# Altium project H4_6-port_EtherCAT_Junction_Module.PrjPcb (part 6 of 7)

## Sheet LAN9254_A_P1.SchDoc
size 431 x 279 mm; DocumentNumber: 4; SheetNumber: 4; SheetTotal: 13
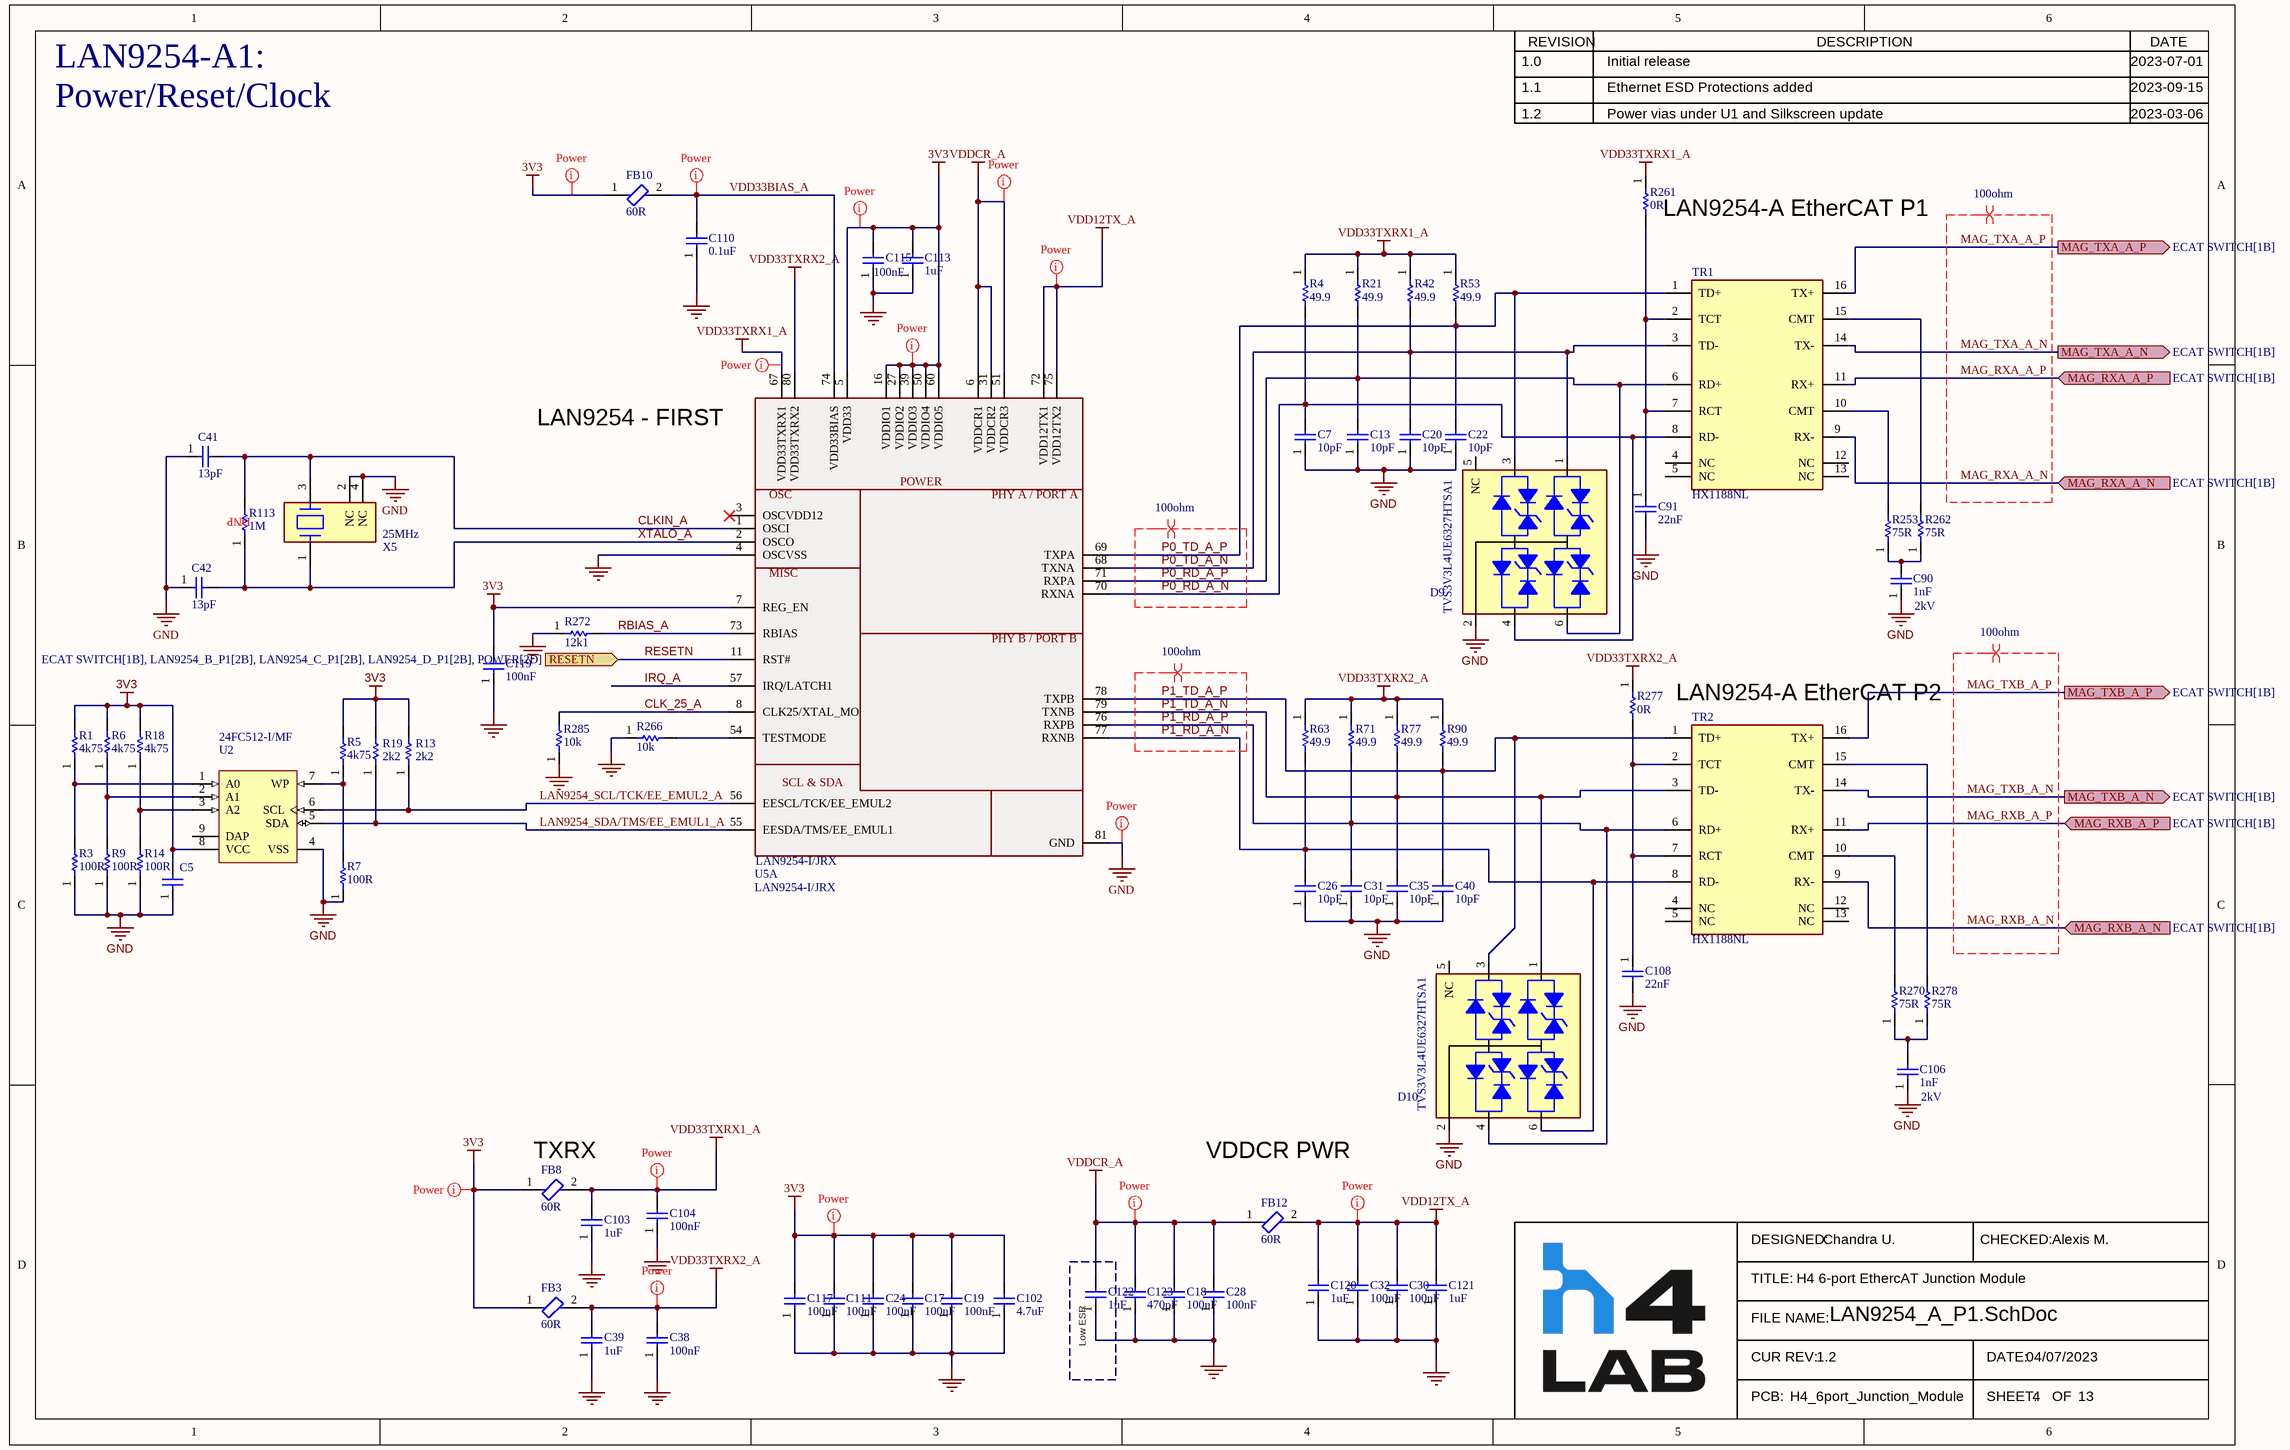
[diagram p9: LAN9254_A_P1.SchDoc]

### Parts
C5  GRM155R71C104JA88D  [CAPC1005X03N(0402)]  (value not drawn)
C7  value 10pF  [0402_C]  (hidden comment: C0402C100J5GAC7411)
C13  value 10pF  [0402_C]  (hidden comment: C0402C100J5GAC7411)
C17  value 100nF  [CAPC1005X03N(0402)]  (hidden comment: GRM155R71C104JA88D)
C18  value 100nF  [CAPC1005X03N(0402)]  (hidden comment: GRM155R71C104JA88D)
C19  value 100nF  [CAPC1005X03N(0402)]  (hidden comment: GRM155R71C104JA88D)
C20  value 10pF  [0402_C]  (hidden comment: C0402C100J5GAC7411)
C22  value 10pF  [0402_C]  (hidden comment: C0402C100J5GAC7411)
C24  value 100nF  [CAPC1005X03N(0402)]  (hidden comment: GRM155R71C104JA88D)
C26  value 10pF  [0402_C]  (hidden comment: C0402C100J5GAC7411)
C28  value 100nF  [CAPC1005X03N(0402)]  (hidden comment: GRM155R71C104JA88D)
C30  value 100nF  [CAPC1005X03N(0402)]  (hidden comment: GRM155R71C104JA88D)
C31  value 10pF  [0402_C]  (hidden comment: C0402C100J5GAC7411)
C32  value 100nF  [CAPC1005X03N(0402)]  (hidden comment: GRM155R71C104JA88D)
C35  value 10pF  [0402_C]  (hidden comment: C0402C100J5GAC7411)
C38  value 100nF  [CAPC1005X03N(0402)]  (hidden comment: GRM155R71C104JA88D)
C39  value 1uF  [CAPC1608X09N(0603)]  (hidden comment: C0603C105K3PACTU)
C40  value 10pF  [0402_C]  (hidden comment: C0402C100J5GAC7411)
C41  value 13pF  [0402_C]  (hidden comment: GRM0225C1H130GA03L)
C42  value 13pF  [0402_C]  (hidden comment: GRM0225C1H130GA03L)
C90  value 1nF  Voltage Rating: 2kV  [CAPC3216X16N(1206)]  (hidden comment: CC1206KKX7RDBB102)
C91  value 22nF  [CAPC1005X03N(0402)]  (hidden comment: GCM155R71H223KA55D)
C102  value 4.7uF  [CAPC3216X16N(1206)]  (hidden comment: CL31B475KBHNNNE)
C103  value 1uF  [CAPC1608X09N(0603)]  (hidden comment: C0603C105K3PACTU)
C104  value 100nF  [CAPC1005X03N(0402)]  (hidden comment: GRM155R71C104JA88D)
C106  value 1nF  Voltage Rating: 2kV  [CAPC3216X16N(1206)]  (hidden comment: CC1206KKX7RDBB102)
C108  value 22nF  [CAPC1005X03N(0402)]  (hidden comment: GCM155R71H223KA55D)
C110  value 0.1uF  [CAPC1608X09N(0603)]  (hidden comment: CL10B104KC8NNNC)
C111  value 100nF  [CAPC1005X03N(0402)]  (hidden comment: GRM155R71C104JA88D)
C113  value 1uF  [0603_C]  (hidden comment: LMK107BJ105KA-T)
C115  value 100nF  [CAPC1005X03N(0402)]  (hidden comment: GRM155R71C104JA88D)
C117  value 100nF  [CAPC1005X03N(0402)]  (hidden comment: GRM155R71C104JA88D)
C119  value 100nF  [CAPC1005X03N(0402)]  (hidden comment: GRM155R71C104JA88D)
C120  value 1uF  [CAPC1608X09N(0603)]  (hidden comment: C0603C105K3PACTU)
C121  value 1uF  [CAPC1608X09N(0603)]  (hidden comment: C0603C105K3PACTU)
C122  value 1uF  [0603_C]  (hidden comment: LMK107BJ105KA-T)
C123  value 470pF  [CAPC1005X03N(0402)]  (hidden comment: GCM1555C1H471JA16D)
D9  TVS3V3L4UE6327HTSA1  [FP-SOT457-MFG]
D10  TVS3V3L4UE6327HTSA1  [FP-SOT457-MFG]
FB3  Impedance: 60R  [FP-BKP2125-IPC_C]  (hidden comment: BKP2125HS600-T)
FB8  Impedance: 60R  [FP-BKP2125-IPC_C]  (hidden comment: BKP2125HS600-T)
FB10  Impedance: 60R  [FP-BKP2125-IPC_C]  (hidden comment: BKP2125HS600-T)
FB12  Impedance: 60R  [FP-BKP2125-IPC_C]  (hidden comment: BKP2125HS600-T)
R1  value 4k75  [RESC1005X06N(0402)]  (hidden comment: RC0402FR-074K75L)
R3  value 100R  [0402]  (hidden comment: CRGCQ0402F100R)
R4  value 49.9  [RESC1005X06N(0402)]  (hidden comment: CRCW040249R9FKED)
R5  value 4k75  [RESC1005X06N(0402)]  (hidden comment: RC0402FR-074K75L)
R6  value 4k75  [RESC1005X06N(0402)]  (hidden comment: RC0402FR-074K75L)
R7  value 100R  [0402]  (hidden comment: CRGCQ0402F100R)
R9  value 100R  [0402]  (hidden comment: CRGCQ0402F100R)
R13  value 2k2  [0402]  (hidden comment: CRCW04022K20JNED)
R14  value 100R  [0402]  (hidden comment: CRGCQ0402F100R)
R18  value 4k75  [RESC1005X06N(0402)]  (hidden comment: RC0402FR-074K75L)
R19  value 2k2  [0402]  (hidden comment: CRCW04022K20JNED)
R21  value 49.9  [RESC1005X06N(0402)]  (hidden comment: CRCW040249R9FKED)
R42  value 49.9  [RESC1005X06N(0402)]  (hidden comment: CRCW040249R9FKED)
R53  value 49.9  [RESC1005X06N(0402)]  (hidden comment: CRCW040249R9FKED)
R63  value 49.9  [RESC1005X06N(0402)]  (hidden comment: CRCW040249R9FKED)
R71  value 49.9  [RESC1005X06N(0402)]  (hidden comment: CRCW040249R9FKED)
R77  value 49.9  [RESC1005X06N(0402)]  (hidden comment: CRCW040249R9FKED)
R90  value 49.9  [RESC1005X06N(0402)]  (hidden comment: CRCW040249R9FKED)
R113  value 1M  [RESC1608X09N(0603)]  (hidden comment: RC0603FR-071ML)
R253  value 75R  [RESC1005X06N(0402)]  (hidden comment: CRCW040275R0FKEDC)
R261  value 0R  [0402]  (hidden comment: RCS04020000Z0ED)
R262  value 75R  [RESC1005X06N(0402)]  (hidden comment: CRCW040275R0FKEDC)
R266  value 10k  [RESC1005X06N(0402)]  (hidden comment: RC0402FR-0710KL)
R270  value 75R  [RESC1005X06N(0402)]  (hidden comment: CRCW040275R0FKEDC)
R272  value 12k1  [RESC1005X06N(0402)]  (hidden comment: RC0402FR-0712K1L)
R277  value 0R  [0402]  (hidden comment: RCS04020000Z0ED)
R278  value 75R  [RESC1005X06N(0402)]  (hidden comment: CRCW040275R0FKEDC)
R285  value 10k  [RESC1005X06N(0402)]  (hidden comment: RC0402FR-0710KL)
TR1  HX1188NL  [FP-HX1188NL-MFG]
TR2  HX1188NL  [FP-HX1188NL-MFG]
U2  24FC512-I/MF  [DFNS-MF8]
U5  LAN9254-I/JRX  [QFP50P1400X1400X120-81N]  (part A of 2)
X5  Frequency: 25MHz  [FP-XRCGB-MFG]  (hidden comment: XRCGB25M000F3A00R0)

### Blocks framed on the sheet
Low ESR: C122

### Ports
MAG_RXA_A_N (in, see ECAT SWITCH[1B]), MAG_RXA_A_P (in, see ECAT SWITCH[1B]), MAG_RXB_A_N (in, see ECAT SWITCH[1B]), MAG_RXB_A_P (in, see ECAT SWITCH[1B]), MAG_TXA_A_N (out, see ECAT SWITCH[1B]), MAG_TXA_A_P (out, see ECAT SWITCH[1B]), MAG_TXB_A_N (out, see ECAT SWITCH[1B]), MAG_TXB_A_P (out, see ECAT SWITCH[1B]), RESETN (in, see ECAT SWITCH[1B], LAN9254_B_P1[2B], LAN9254_C_P1[2B], LAN9254_D_P1[2B], POWER[2D])

### Nets
3V3: C5.2 C17.2 C19.2 C24.2 C102.2 C111.2 C113.2 C115.2 C117.2 C119.2 FB3.1 FB8.1 FB10.1 R1.2 R5.2 R6.2 R13.2 R18.2 R19.2 U2.8(VCC) U5.5(VDD33) U5.7(REG_EN) U5.16(VDDIO1) U5.27(VDDIO2) U5.39(VDDIO3) U5.50(VDDIO4) U5.60(VDDIO5)
GND: C5.1 C7.1 C13.1 C17.1 C18.1 C19.1 C20.1 C22.1 C24.1 C26.1 C28.1 C30.1 C31.1 C32.1 C35.1 C38.1 C39.1 C40.1 C41.1 C42.1 C90.1 C91.2 C102.1 C103.1 C104.1 C106.1 C108.2 C110.1 C111.1 C113.1 C115.1 C117.1 C119.1 C120.1 C121.1 C122.1 C123.1 D9.2(GND) D10.2(GND) R3.1 R7.1 R9.1 R14.1 R266.1 R272.1 R285.1 U2.4(VSS) U5.4(OSCVSS) U5.81(GND) X5.2(NC) X5.4(NC)
VDD12TX_A: C30.2 C32.2 C120.2 C121.2 FB12.2 U5.72(VDD12TX1) U5.75(VDD12TX2)
VDD33TXRX1_A: C103.2 C104.2 FB8.2 R4.1 R21.1 R42.1 R53.1 R261.1 U5.67(VDD33TXRX1)
VDD33TXRX2_A: C38.2 C39.2 FB3.2 R63.1 R71.1 R77.1 R90.1 R277.1 U5.80(VDD33TXRX2)
VDDCR_A: C18.2 C28.2 C122.2 C123.2 FB12.1 U5.6(VDDCR1) U5.31(VDDCR2) U5.51(VDDCR3)
CLK_25_A: R285.2 U5.8(CLK25/XTAL_MO)
CLKIN_A: C41.2 R113.2 U5.1(OSCI) X5.3
IRQ_A: U5.57(IRQ/LATCH1)
LAN9254_SCL/TCK/EE_EMUL2_A: R13.1 U2.6(SCL) U5.56(EESCL/TCK/EE_EMUL2)
LAN9254_SDA/TMS/EE_EMUL1_A: R19.1 U2.5(SDA) U5.55(EESDA/TMS/EE_EMUL1)
MAG_RXA_A_N: TR1.9(RX-) ; port MAG_RXA_A_N
MAG_RXA_A_P: TR1.11(RX+) ; port MAG_RXA_A_P
MAG_RXB_A_N: TR2.9(RX-) ; port MAG_RXB_A_N
MAG_RXB_A_P: TR2.11(RX+) ; port MAG_RXB_A_P
MAG_TXA_A_N: TR1.14(TX-) ; port MAG_TXA_A_N
MAG_TXA_A_P: TR1.16(TX+) ; port MAG_TXA_A_P
MAG_TXB_A_N: TR2.14(TX-) ; port MAG_TXB_A_N
MAG_TXB_A_P: TR2.16(TX+) ; port MAG_TXB_A_P
P0_RD_A_N: C7.2 D9.4 R4.2 TR1.8(RD-) U5.70(RXNA)
P0_RD_A_P: C13.2 D9.6 R21.2 TR1.6(RD+) U5.71(RXPA)
P0_TD_A_N: C20.2 D9.1 R42.2 TR1.3(TD-) U5.68(TXNA)
P0_TD_A_P: C22.2 D9.3 R53.2 TR1.1(TD+) U5.69(TXPA)
P1_RD_A_N: C26.2 D10.6 R63.2 TR2.8(RD-) U5.77(RXNB)
P1_RD_A_P: C31.2 D10.4 R71.2 TR2.6(RD+) U5.76(RXPB)
P1_TD_A_N: C35.2 D10.1 R77.2 TR2.3(TD-) U5.79(TXNB)
P1_TD_A_P: C40.2 D10.3 R90.2 TR2.1(TD+) U5.78(TXPB)
RBIAS_A: R272.2 U5.73(RBIAS)
RESETN: U5.11(RST#) ; port RESETN
VDD33BIAS_A: C110.2 FB10.2 U5.74(VDD33BIAS)
XTALO_A: C42.2 R113.1 U5.2(OSCO) X5.1
NetC90_2: C90.2 R253.1 R262.1
NetC91_1: C91.1 R261.2 TR1.2(TCT) TR1.7(RCT)
NetC106_2: C106.2 R270.1 R278.1
NetC108_1: C108.1 R277.2 TR2.2(TCT) TR2.7(RCT)
NetR1_1: R1.1 R3.2 U2.1(A0)
NetR5_1: R5.1 R7.2 U2.7(WP)
NetR6_1: R6.1 R9.2 U2.2(A1)
NetR14_2: R14.2 R18.1 U2.3(A2)
NetR253_2: R253.2 TR1.10(CMT)
NetR262_2: R262.2 TR1.15(CMT)
NetR266_2: R266.2 U5.54(TESTMODE)
NetR270_2: R270.2 TR2.10(CMT)
NetR278_2: R278.2 TR2.15(CMT)

Not connected (* = marked no-connect by the designer): D9 5(NC); D10 5(NC); TR1 4(NC) 5(NC) 12(NC) 13(NC); TR2 4(NC) 5(NC) 12(NC) 13(NC); U2 9(DAP); U5 3(OSCVDD12)*

### Layout directives
net class Power: 3V3, GND, VDD12TX_A, VDD33BIAS_A, VDD33TXRX1_A, VDD33TXRX2_A, VDDCR_A
differential pair; differential pair class 100ohm: MAG_RXA_A_N, MAG_RXA_A_P, MAG_RXB_A_N, MAG_RXB_A_P, MAG_TXA_A_N, MAG_TXA_A_P, MAG_TXB_A_N, MAG_TXB_A_P, P0_RD_A_N, P0_RD_A_P, P0_TD_A_N, P0_TD_A_P, P1_RD_A_N, P1_RD_A_P, P1_TD_A_N, P1_TD_A_P

### Notes on the sheet
- LAN9254-A1:
- Power/Reset/Clock
- (near R261) LAN9254-A EtherCAT P1
- (near U5) LAN9254 - FIRST
- (near R113) DNP
- LAN9254-A EtherCAT P2
- (near FB8) TXRX
- VDDCR PWR
- REVISION
- DESCRIPTION
- DATE
- DESIGNED:
- CHECKED:
- TITLE:
- FILE NAME:
- CUR REV:
- PCB:
- SHEET:
- DATE:
- OF
- (in symbol LAN9254-I/JRX, part A) POWER; OSC; PHY A / PORT A; MISC; PHY B / PORT B; SCL & SDA

### Library data of the parts
C5 = 100nF_16V_0402_CAP: CAP CER 0.1UF 16V X7R 0402; Value: 100nF; Tolerance: 5%; MPN: GRM155R71C104JA88D; Voltage Rating: 16V; Temp Coeff: X7R; Size/Package: 0402
C7 C13 C20 C22 C26 C31 C35 C40 = 10pF_50V_0402_C0402C100J5GAC7411: Cap Ceramic 10pF 50V C0G 5% SMD 0402 125°C Punched Paper T/R; Manufacturer: KEMET; Tolerance: 5%; Supplier 1: Digi-Key; Manufacturer Part Number: C0402C100J5GAC7411; RoHS: Yes; Category: Ceramic Capacitors; Stock 1: 39987; Pricing 1: 1=0.10000, 10=0.03500, 50=0.01940, 100=0.01580, 500=0.01128, 1000=0.00886, 2500=0.00805, 5000=0.00741 (USD); Case/Package: 0402; Dielectric Material: Ceramic; Min Operating Temperature: -55°C; Max Operating Temperature: 125°C; Packaging: Tape and Reel; Capacitance: 10pF; Dielectric: C0G; Voltage Rating (DC): 50V; Length: 1mm; Depth: 0.5mm; Lead Free: Lead Free; RoHS Compliant: Yes; ComponentLink1URL: http://components.arrow.com/part/dataview/0323_00309912?src-supplier=Arrow+Europe; ComponentLink1Description: http://components.arrow.com/part/dataview/0323_00309912?src-supplier=Arrow+Europe; Supplier Part Number 1: 399-C0402C100J5GAC7411CT-ND
C17-C19 C24 C28 C30 C32 C38 C104 C111 C115 C117 C119 = 100nF_16V_0402_CAP: CAP CER 0.1UF 16V X7R 0402; Tolerance: 5%; MPN: GRM155R71C104JA88D; Voltage Rating: 16V; Temp Coeff: X7R; Size/Package: 0402
C39 C103 C120 C121 = 1uF_25VDC_0603_Cap: MLCC - SMD/SMT 25volts 1uF X5R 10%; Voltage: 25VDC; Drawn By: TC; MPN: C0603C105K3PACTU; Tolerance: 10%; Supplier 1: Mouser; Supplier Part Number 1: 80-C0603C105K3PAC
C41 C42 = 13pF_50V_0402_CAP_GRM0225C1H130GA03L: Cap Ceramic Monolithic 13pF 50VDC 2% SMD Emboss T/R; Manufacturer: Murata; Supplier 1: Digi-Key; Manufacturer Part Number: GRM0225C1H130GA03L; RoHS: Yes; Category: Ceramic Capacitors; Pricing 1: 40000=0.01108 (USD); RoHS Compliant: Yes; Supplier Part Number 1: 490-GRM0225C1H130GA03LTR-ND
C90 C106 = 1nF_2kV_1206_CAP: CAP CER 1000PF 2KV X7R 1206; Tolerance: 10%; MPN: CC1206KKX7RDBB102; Temp Coeff: X7R; Size/Package: 1206
C91 C108 = 22nF_50V_0402_CAP: CAP CER 0.022UF 50V X7R 0402; Tolerance: 10%; MPN: GCM155R71H223KA55D; Voltage Rating: 50V; Temp Coeff: X7R; Size/Package: 0402; Mounting Type: Surface Mounting
C102 = 4.7uF_50V_1206_CAP: CAP CER 4.7UF 50V X7R 1206; Tolerance: 10%; MPN: CL31B475KBHNNNE; Voltage: 50V; Temp Coeff: X7R; Package/Case: 1206
C110 = 0.1uF_100V_0603_CAP: CAP CER 0.1UF 100V X7R 0603; Tolerance: 10%; MPN: CL10B104KC8NNNC; Supplier 1: Digi-Key; Supplier Part Number 1: 1276-6807-1-ND; Volage Rating: 100V; Temp Coefficent: X7R; Mounting Type: Surface Mount; Case/Package: 0603
C113 C122 = 1uF_10V_low_ESR_0603_LMK107BJ105KA-T: Multilayer Ceramic Capacitors (High dielectric type), 10V, 1 uF, ± 10 %, 0603, X5R, RoHS; Manufacturer: Taiyo Yuden; Tolerance: 10%; Supplier 1: Digi-Key; Supplier Part Number 1: 587-4281-1-ND; Manufacturer Part Number: LMK107BJ105KA-T; RoHS: Yes; Category: Ceramic Capacitors; Stock 1: 254397; Pricing 1: 1=0.10000, 10=0.05800, 50=0.03180, 100=0.02590, 500=0.01852, 1000=0.01455 (USD); Mount: Surface Mount; Case/Package: 0603; Case Code (Imperial): 0603; Case Code (Metric): 1608; Min Operating Temperature: -55°C; Max Operating Temperature: 85°C; Packaging: Tape and Reel; Capacitance: 1uF; Voltage Rating (DC): 10V; Dielectric: X5R; Package Quantity: 4000; Voltage Rating: 10V; Termination: SMD/SMT; Resistor Type: Ceramic; Series: M; Construction: Flat; Length: 1.6mm; Width: 0.8mm; Height: 0.8mm; Thickness: 0.035inch; Depth: 0.8mm; Radiation Hardening: No; Lead Free: Lead Free; Halogen Free: Halogen Free; RoHS Compliant: Yes; ComponentLink1URL: https://datasheet.ciiva.com/11596/lmk107bj105ka-t-ss-11596793.pdf?src-supplier=Avnet; ComponentLink1Description: https://datasheet.ciiva.com/11596/lmk107bj105ka-t-ss-11596793.pdf?src-supplier=Avnet; ComponentLink2URL: https://datasheet.ciiva.com/15921/1054lmk107bj105ka-t-15921296.pdf?src-supplier=Onlinecomponents.com; ComponentLink2Description: https://datasheet.ciiva.com/15921/1054lmk107bj105ka-t-15921296.pdf?src-supplier=Onlinecomponents.com; ComponentLink3URL: https://datasheet.ciiva.com/26872/getdatasheetpartid-637529-26872638.pdf?src-supplier=Verical; ComponentLink3Description: https://datasheet.ciiva.com/26872/getdatasheetpartid-637529-26872638.pdf?src-supplier=Verical; ComponentLink4URL: https://datasheet.ciiva.com/30232/584lmk107bj105ka-t-30232760.pdf?src-supplier=Onlinecomponents.com; ComponentLink4Description: https://datasheet.ciiva.com/30232/584lmk107bj105ka-t-30232760.pdf?src-supplier=Onlinecomponents.com
C123 = 470pF_50V_0402_CAP: CAP CER 470PF 50V C0G/NP0 0402; Tolerance: 5%; Temp Coeff: C0G, NP0; MPN: GCM1555C1H471JA16D; Voltage: 50V; Size: 0402
D9 D10 = TVS_DIODE_ETHERCAT_PHY_7.7V_20A_TVS3V3L4UE6327HTSA1: Trans Voltage Suppressor Diode, 3.3V V(RWM), Unidirectional, 4 Element, Silicon; Manufacturer: Infineon; Supplier: Digi-Key; Supplier Part Number: TVS3V3L4UE6327HTSA1CT-ND; Manufacturer Part Number: TVS3V3L4UE6327HTSA1; RoHS: Yes; Category: Diodes; Stock: 273244; Pricing: 1=0.54, 10=0.438, 100=0.2981, 500=0.22356, 1000=0.16767 (USD); Terminal Finish: Tin; Diode Type: TRANS VOLTAGE SUPPRESSOR; Moisture Sensitivity Level: 1; JESD-609 Code: e3; Reach SVHC Compliant: Yes; RoHS Compliant: Yes; ComponentLink1URL: https://datasheet.ciiva.com:443/pdfs/VipMasterIC/IC/INFN/INFNS19177/INFNS19177-1.pdf?src-supplier=IHS+Markit; ComponentLink1Description: https://datasheet.ciiva.com:443/pdfs/VipMasterIC/IC/INFN/INFNS19177/INFNS19177-1.pdf?src-supplier=IHS+Markit; ComponentLink2URL: http://www.farnell.com/datasheets/1945807.pdf?src-supplier=Farnell; ComponentLink2Description: http://www.farnell.com/datasheets/1945807.pdf?src-supplier=Farnell; ComponentLink3URL: http://www.mouser.com/ds/2/196/Infineon-TVS3V3L4U-DS-v02_04-en-469488.pdf?src-supplier=Mouser; ComponentLink3Description: http://www.mouser.com/ds/2/196/Infineon-TVS3V3L4U-DS-v02_04-en-469488.pdf?src-supplier=Mouser; ComponentLink4URL: http://www.farnell.com/datasheets/1945807.pdf?src-supplier=Element14; ComponentLink4Description: http://www.farnell.com/datasheets/1945807.pdf?src-supplier=Element14; ComponentLink5URL: http://www.farnell.com/datasheets/1945807.pdf?src-supplier=Newark; ComponentLink5Description: http://www.farnell.com/datasheets/1945807.pdf?src-supplier=Newark; ComponentLink6URL: http://www.infineon.com/dgdl/Infineon-TVS3V3L4U-DS-v02_04-en.pdf?fileId=db3a3043382e837301385be7912532ed&src-supplier=Avnet; ComponentLink6Description: http://www.infineon.com/dgdl/Infineon-TVS3V3L4U-DS-v02_04-en.pdf?fileId=db3a3043382e837301385be7912532ed&src-supplier=Avnet; ComponentLink7URL: https://www.infineon.com/dgdl/TVS3V3L4U_rev_2_2.pdf?folderId=db3a30431f848401011fcbf2ab4c04c4&fileId=db3a3043382e837301385be7912532ed&src-supplier=Digi-Key; ComponentLink7Description: https://www.infineon.com/dgdl/TVS3V3L4U_rev_2_2.pdf?folderId=db3a30431f848401011fcbf2ab4c04c4&fileId=db3a3043382e837301385be7912532ed&src-supplier=Digi-Key; ComponentLink8URL: https://www.infineon.com/dgdl/TVS3V3L4U_rev_2_2.pdf?folderId=db3a30431f848401011fcbf2ab4c04c4&amp;fileId=db3a3043382e837301385be7912532ed&src-supplier=Digi-Key; ComponentLink8Description: https://www.infineon.com/dgdl/TVS3V3L4U_rev_2_2.pdf?folderId=db3a30431f848401011fcbf2ab4c04c4&amp;fileId=db3a3043382e837301385be7912532ed&src-supplier=Digi-Key
FB3 FB8 FB10 FB12 = 60R_100Mhz_0805_3A: TAIYO YUDEN - BKP2125HS600-T - Ferrite Bead, 0805 [2012 Metric], 60 ohm, 3 A, BKP Series, 0.025 ohm, ± 25%; Max DC Current: 3A; Number of Lines: 1; DC Resistance (DCR): 25mR; Test Frequency: 100MHz; Shielding: Unshielded; Packaging: Tape and Reel; Case Code (Imperial): 0805; Series: BK; Package Quantity: 1; Tolerance: 25%; Lead Free: Lead Free; Number of Pins: 2; Max Current Rating: 3A; Length: 2.3mm; Case/Package: 0805; Max Operating Temperature: 85°C; Min Operating Temperature: -55°C; Core Material: Ferrite; Case Code (Metric): 2125; Depth: 1.45mm; Resistance: 25mR; Halogen Free: Halogen Free; Termination: SMD/SMT; Width: 0.049inch; RoHS Compliant: Yes; Mount: Surface Mount; Height: 1.05mm; Supplier 1: Digi-Key; Manufacturer: Taiyo Yuden; Manufacturer Part Number: BKP2125HS600-T; RoHS: Yes; Category: Inductors; Stock 1: 308405; Pricing 1: 1=0,12000, 10=0,09400, 25=0,08480, 50=0,06200, 100=0,05360, 250=0,04232, 500=0,03574, 1000=0,03010 (USD); REACH SVHC: Unknown; ComponentLink1URL: https://datasheet.ciiva.com/6213/bkp2125hs600-t-ss-6213090.pdf?src-supplier=Digi-Key; ComponentLink1Description: https://datasheet.ciiva.com/6213/bkp2125hs600-t-ss-6213090.pdf?src-supplier=Digi-Key; ComponentLink2URL: https://datasheet.ciiva.com/30063/884bkp2125hs600-t-30063956.pdf?src-supplier=Onlinecomponents.com; ComponentLink2Description: https://datasheet.ciiva.com/30063/884bkp2125hs600-t-30063956.pdf?src-supplier=Onlinecomponents.com; ComponentLink3URL: https://datasheet.ciiva.com/6213/mlci08-e-6213094.pdf?src-supplier=Digi-Key; ComponentLink3Description: https://datasheet.ciiva.com/6213/mlci08-e-6213094.pdf?src-supplier=Digi-Key; ComponentLink4URL: https://datasheet.ciiva.com/6213/mlci08-e-6213097.pdf?src-supplier=Digi-Key; ComponentLink4Description: https://datasheet.ciiva.com/6213/mlci08-e-6213097.pdf?src-supplier=Digi-Key; Supplier Part Number 1: 587-1932-1-ND
R1 R5 R6 R18 = 4k75_1/16_0402_RES: RES SMD 4.75K OHM 1% 1/16W 0402; Power: 1/16; MPN: RC0402FR-074K75L; Tolerance: 1%; Package/Case: 0402
R3 R7 R9 R14 = 100R_1/16_0402_RES: Res Thick Film 0402 100 Ohm 1% 0.063W(1/16W) ±200ppm/C Pad SMD Automotive T/R; Manufacturer: TE Connectivity; Max Power Dissipation: 63mW; Temperature Coefficient: 200ppm/°C; Supplier 1: Digi-Key; Manufacturer Part Number: CRGCQ0402F100R; RoHS: Yes; Category: Chip SMD Resistors; Stock 1: 151133; Pricing 1: 1=0.10000, 10=0.02600, 100=0.01040, 1000=0.00466, 2500=0.00405, 5000=0.00334 (USD); Case/Package: 0402; Case Code (Imperial): 0402; Case Code (Metric): 1005; Min Operating Temperature: -55°C; Max Operating Temperature: 155°C; Resistor Type: Thick Film; Features: Moisture Resistant,Automotive AEC-Q200; Packaging: Cut Tape; Resistance: 100R; Tolerance: 1%; Number of Terminations: 2; RoHS Compliant: Yes; ComponentLink1URL: https://www.te.com/commerce/DocumentDelivery/DDEController?Action=srchrtrv&amp;DocNm=1773204-3&amp;DocType=DS&amp;DocLang=English&src-supplier=Digi-Key; ComponentLink1Description: https://www.te.com/commerce/DocumentDelivery/DDEController?Action=srchrtrv&amp;DocNm=1773204-3&amp;DocType=DS&amp;DocLang=English&src-supplier=Digi-Key; ComponentLink2URL: https://4donline.ihs.com/images/VipMasterIC/IC/TYEL/TYEL-S-A0004929575/TYEL-S-A0004929575-1.pdf?hkey=52A5661711E402568146F3353EA87419&src-supplier=Element14; ComponentLink2Description: https://4donline.ihs.com/images/VipMasterIC/IC/TYEL/TYEL-S-A0004929575/TYEL-S-A0004929575-1.pdf?hkey=52A5661711E402568146F3353EA87419&src-supplier=Element14; ComponentLink3URL: https://4donline.ihs.com/images/VipMasterIC/IC/TYEL/TYEL-S-A0004929575/TYEL-S-A0004929575-1.pdf?hkey=52A5661711E402568146F3353EA87419&src-supplier=Newark; ComponentLink3Description: https://4donline.ihs.com/images/VipMasterIC/IC/TYEL/TYEL-S-A0004929575/TYEL-S-A0004929575-1.pdf?hkey=52A5661711E402568146F3353EA87419&src-supplier=Newark; ComponentLink4URL: https://4donline.ihs.com/images/VipMasterIC/IC/TYEL/TYEL-S-A0004929575/TYEL-S-A0004929575-1.pdf?hkey=52A5661711E402568146F3353EA87419&src-supplier=Farnell; ComponentLink4Description: https://4donline.ihs.com/images/VipMasterIC/IC/TYEL/TYEL-S-A0004929575/TYEL-S-A0004929575-1.pdf?hkey=52A5661711E402568146F3353EA87419&src-supplier=Farnell; Supplier Part Number 1: A129615CT-ND
R4 R21 R42 R53 R63 R71 R77 R90 = 49R9_1/10W_0402_RES: RES SMD 49.9 OHM 1% 1/16W 0402; MPN: CRCW040249R9FKED; Wattage: 1/16W; Drawn By: TC; Tolerance: 1%; Supplier 1: Digi-Key; Supplier Part Number 1: 541-49.9LCT-ND
R13 R19 = 2k2_1/16_0402_CRCW04022K20JNED_RES: Vishay CRCW Series Thick Film Resistor 0402 Case 2.2k 5% 0.063W 200ppm/K; Manufacturer: Vishay Dale; Resistance: 2.2kR; Temperature Coefficient: 200ppm/°C; Max Power Dissipation: 63mW; Voltage Rating: 50V; Tolerance: 5%; Supplier 1: Digi-Key; Manufacturer Part Number: CRCW04022K20JNED; RoHS: Yes; Category: Chip SMD Resistors; Stock 1: 5003; Pricing 1: 1=0,10000, 10=0,03300, 100=0,01360, 1000=0,00610, 2500=0,00529, 5000=0,00437 (USD); Mount: Surface Mount; Case/Package: 0402; Case Code (Imperial): 0402; Case Code (Metric): 1005; Contact Plating: Tin; Weight: 2.3E-05oz; Size Code: 0402; Min Operating Temperature: -55°C; Max Operating Temperature: 155°C; Resistor Type: Thick Film; Packaging: Tape and Reel; Number of Terminations: 2; Power Rating: 63mW; Package Quantity: 1; Features: Automotive AEC-Q200; Termination: SMD/SMT; Voltage Rating (DC): 50V; Series: CRCW; Resistance Tolerance: 5%; Construction: Rectangular; Technology: THICK FILM; Length: 1mm; Width: 0.5mm; Height: 0.35mm; Depth: 0.5mm; Radiation Hardening: No; RoHS Compliant: Yes; Lead Free: Lead Free; REACH SVHC: Unknown; Military Standard: Not; ComponentLink1URL: https://datasheet.ciiva.com/5542/dcrcwe3-109170-5542006.pdf?src-supplier=Mouser; ComponentLink1Description: https://datasheet.ciiva.com/5542/dcrcwe3-109170-5542006.pdf?src-supplier=Mouser; ComponentLink2URL: https://datasheet.ciiva.com/3256/dcrcwe3-3256342.pdf?src-supplier=Avnet; ComponentLink2Description: https://datasheet.ciiva.com/3256/dcrcwe3-3256342.pdf?src-supplier=Avnet; ComponentLink3URL: https://datasheet.ciiva.com/3256/dcrcwe3-3256343.pdf?src-supplier=Avnet; ComponentLink3Description: https://datasheet.ciiva.com/3256/dcrcwe3-3256343.pdf?src-supplier=Avnet; ComponentLink4URL: https://datasheet.ciiva.com/2462/dcrcwe3-2462040.pdf?src-supplier=Digi-Key; ComponentLink4Description: https://datasheet.ciiva.com/2462/dcrcwe3-2462040.pdf?src-supplier=Digi-Key; ComponentLink5URL: https://datasheet.ciiva.com/2462/dcrcwe3-2462041.pdf?src-supplier=Digi-Key; ComponentLink5Description: https://datasheet.ciiva.com/2462/dcrcwe3-2462041.pdf?src-supplier=Digi-Key; ComponentLink6URL: https://datasheet.ciiva.com/2462/dcrcwe3-2462042.pdf?src-supplier=Digi-Key; ComponentLink6Description: https://datasheet.ciiva.com/2462/dcrcwe3-2462042.pdf?src-supplier=Digi-Key; ComponentLink7URL: https://datasheet.ciiva.com/16760/70201119-16760139.pdf?src-supplier=Allied+Electronics; ComponentLink7Description: https://datasheet.ciiva.com/16760/70201119-16760139.pdf?src-supplier=Allied+Electronics; ComponentLink8URL: https://datasheet.ciiva.com/16436/dcrcwe3-16436154.pdf?src-supplier=Future+Electronics; ComponentLink8Description: https://datasheet.ciiva.com/16436/dcrcwe3-16436154.pdf?src-supplier=Future+Electronics; ComponentLink9URL: https://datasheet.ciiva.com/7743/dcrcwe3-7743566.pdf?src-supplier=Element14; ComponentLink9Description: https://datasheet.ciiva.com/7743/dcrcwe3-7743566.pdf?src-supplier=Element14; Supplier Part Number 1: 541-2.2KJCT-ND
R113 = 1M_1/10W_RES_0603: RES SMD 1M OHM 1% 1/10W 0603; MPN: RC0603FR-071ML; Tolerance: 1%; Power: 1/10W; Size: 0603; Supplier 1: Digi-Key; Supplier Part Number 1: 311-1.00MHRCT-ND
R253 R262 R270 R278 = 75R_1/10W_0402_RES: RES SMD 75 OHM 1% 1/16W 0402; Tolerance: +/-1%; MPN: CRCW040275R0FKEDC; Wattage: 1/16W; Drawn By: TC; Size/Package: 0402
R261 R277 = 0R_1/5W_0402_RCS04020000Z0ED_RES: VISHAY - RCS04020000Z0ED - SMD Chip Resistor, 0402 [1005 Metric], 0 ohm, RCS Series, 50 V, Thick Film, 200 mW; Manufacturer: Vishay Dale; Resistance: 0mR; Max Power Dissipation: 200mW; Supplier 1: Digi-Key; Supplier Part Number 1: 541-2877-1-ND; Manufacturer Part Number: RCS04020000Z0ED; RoHS: Yes; Category: Chip SMD Resistors; Stock 1: 18214; Pricing 1: 1=0.10000, 10=0.08300, 25=0.05760, 50=0.04480, 100=0.03200, 250=0.02496, 500=0.01984, 1000=0.01408, 5000=0.01088 (USD); Case/Package: 0402; Case Code (Metric): 1005; Case Code (Imperial): 0402; Min Operating Temperature: -55°C; Max Operating Temperature: 155°C; Packaging: Tape and Reel; Resistor Type: Thick Film; Number of Terminations: 2; Features: Automotive AEC-Q200; Length: 0.039inch; Width: 0.02inch; Height: 0.016inch; RoHS Compliant: Yes; ComponentLink1URL: http://www.farnell.com/datasheets/2618474.pdf?src-supplier=Farnell; ComponentLink1Description: http://www.farnell.com/datasheets/2618474.pdf?src-supplier=Farnell; ComponentLink2URL: http://www.vishay.com/docs/20065/rcse3.pdf?src-supplier=Digi-Key; ComponentLink2Description: http://www.vishay.com/docs/20065/rcse3.pdf?src-supplier=Digi-Key; ComponentLink3URL: http://www.farnell.com/datasheets/2618474.pdf?src-supplier=Element14; ComponentLink3Description: http://www.farnell.com/datasheets/2618474.pdf?src-supplier=Element14; ComponentLink4URL: http://www.farnell.com/datasheets/2618474.pdf?src-supplier=Newark; ComponentLink4Description: http://www.farnell.com/datasheets/2618474.pdf?src-supplier=Newark
R266 R285 = 10k_1/16W_0402_RES: RES SMD 10K OHM 1% 1/16W 0402; Tolerance: 1%; Power: 1/16W; Size: 0402; MPN: RC0402FR-0710KL
R272 = 12k1_1/16W-0402_RES: RES SMD 12.1K OHM 1% 1/16W 0402; MPN: RC0402FR-0712K1L; Tolerance: 1%; Power: 1/16W; Case/Package: 0402
TR1 TR2 = HX1188NL_TRANSFO_LAN_-40-85DEG: Datacom Transformer, GENERAL PURPOSE Application(s), 1:1; 1:1; Manufacturer: Pulse; Isolation Voltage: 1.65kV; Channels: 1; Primary Inductance: 350uH; Manufacturer Part Number: HX1188NL; RoHS: Yes; Category: Transformers; Min Operating Temperature: -40°C; Max Operating Temperature: 85°C; Turns Ratio: 1:1; Packaging: Rail/Tube; Length: 12.7mm; Width: 7.11mm; Height: 5.97mm; RoHS Compliant: Yes; ComponentLink1URL: https://datasheet.ciiva.com:443/pdfs/VipMasterIC/IC/PLEI/PLEI-S-A0005794621/PLEI-S-A0005794621-1.pdf?src-supplier=IHS+Markit; ComponentLink1Description: https://datasheet.ciiva.com:443/pdfs/VipMasterIC/IC/PLEI/PLEI-S-A0005794621/PLEI-S-A0005794621-1.pdf?src-supplier=IHS+Markit; Supplier: Digi-Key; Supplier Part Number: 553-1340-5-ND; Stock: 14377; Pricing: 1=5.68, 10=4.314, 25=4.2004, 50=3.86, 100=3.6329, 250=3.5194, 500=3.40588, 1000=3.29234 (USD); Mounting Technology: Surface Mount; Terminal Finish: Nickel; Application(s): GENERAL PURPOSE; Transformer Type: DATACOM TRANSFORMER; JESD-609 Code: e3; Reach SVHC Compliant: Yes; ComponentLink2URL: https://datasheet.ciiva.com/2938/+hj603-2938785.pdf?src-supplier=Digi-Key; ComponentLink2Description: https://datasheet.ciiva.com/2938/+hj603-2938785.pdf?src-supplier=Digi-Key
U2 = EEPROM_512kb_1MHz_24FC512-I/MF: EEPROM Serial-2Wire 512K-bit 64K x 8 1.8V/2.5V/3.3V/5V 8-Pin DFN-S EP Tube; Manufacturer: Microchip; Interface: I2C,Serial; Frequency: 400kHz; Min Supply Voltage: 1.7V; Max Supply Voltage: 5.5V; Access Time: 400ns; Nominal Supply Current: 5mA; Density: 512Kb; Max Frequency: 1MHz; Organization: 64KX8; Access Time-Max: 900ns; Write Protection: YES; Write Cycle Time-Max (tWC): 5ms; Supplier 1: Digi-Key; Manufacturer Part Number: 24FC512-I/MF; RoHS: Yes; Category: EEPROM; Pricing 1: 1=2.16000 (USD); Mount: Surface Mount; Number of Pins: 8; Contact Plating: Tin,Matte; Min Operating Temperature: -40°C; Max Operating Temperature: 85°C; Packaging: Rail/Tube; Memory Type: EEPROM; Package Quantity: 60; Memory Size: 512Kb; Supply Current: 5mA; REACH SVHC: No SVHC; Lead Free: Lead Free; RoHS Compliant: Yes; ComponentLink1URL: https://datasheet.ciiva.com/3185/21754m-3185247.pdf?src-supplier=Avnet; ComponentLink1Description: https://datasheet.ciiva.com/3185/21754m-3185247.pdf?src-supplier=Avnet; Supplier Part Number 1: 24FC512-I/MF-ND; Case/Package: DFN; Programming Voltage: 5.5V; Supply Voltage-Nom: 5.5V; Radiation Hardening: No; ComponentLink2URL: https://datasheet.ciiva.com/16321/filehandler-aspxddocname-en546203-16321085.pdf?src-supplier=Future+Electronics; ComponentLink2Description: https://datasheet.ciiva.com/16321/filehandler-aspxddocname-en546203-16321085.pdf?src-supplier=Future+Electronics
U5 = LAN9254-I/JRX: 2/3-PORT Ethercat Slave Controller With 32 Digios With Integrated Ethernet Phys; Manufacturer: Microchip; Supplier 1: Digi-Key; Manufacturer Part Number: LAN9254-I/JRX; RoHS: Yes; Pricing 1: 1=14.24000, 25=12.99000 (USD); RoHS Compliant: Yes; Supplier Part Number 1: 150-LAN9254-I/JRX-ND
X5 = 25MHz_Crystal_2016_35PPM_XRCGB25M000F3A00R0: Crystal 25MHz ±30ppm (Tol) ±35ppm (Stability) 6pF 100Ohm Automotive 4-Pin SMD T/R; Manufacturer: Murata; ESR (Equivalent Series Resistance): 100R; Frequency Stability: 100ppm; Load Capacitance: 6pF; Supplier 1: Digi-Key; Manufacturer Part Number: XRCGB25M000F3A00R0; RoHS: Yes; Category: Crystals; Stock 1: 53614; Pricing 1: 1=0.56000, 10=0.46300, 50=0.41640, 100=0.37010, 500=0.35156, 1000=0.29605 (USD); Mount: Surface Mount; Case/Package: SMD/SMT; Min Operating Temperature: -40°C; Max Operating Temperature: 125°C; Packaging: Tape and Reel; Frequency Tolerance: 35ppm; Length: 0.079inch; Width: 0.063inch; Height: 0.028inch; Ratings: AEC-Q200; RoHS Compliant: Yes; ComponentLink1URL: http://www.farnell.com/datasheets/2631968.pdf?src-supplier=Farnell; ComponentLink1Description: http://www.farnell.com/datasheets/2631968.pdf?src-supplier=Farnell; ComponentLink2URL: http://www.murata.com/~/media/webrenewal/products/timingdevice/crystalu/flyers/vppt-hcrj126-d.ashx?la=en&src-supplier=Digi-Key; ComponentLink2Description: http://www.murata.com/~/media/webrenewal/products/timingdevice/crystalu/flyers/vppt-hcrj126-d.ashx?la=en&src-supplier=Digi-Key; ComponentLink3URL: https://www.murata.com/~/media/webrenewal/products/timingdevice/crystalu/flyers/vppt-hcrj126-d.ashx?la=en&src-supplier=Digi-Key; ComponentLink3Description: https://www.murata.com/~/media/webrenewal/products/timingdevice/crystalu/flyers/vppt-hcrj126-d.ashx?la=en&src-supplier=Digi-Key; ComponentLink4URL: http://www.farnell.com/datasheets/2631968.pdf?src-supplier=Newark; ComponentLink4Description: http://www.farnell.com/datasheets/2631968.pdf?src-supplier=Newark; Supplier Part Number 1: 490-12146-1-ND